# Altium schematic sheet 04_Power_Supply.SchDoc
size A4; SheetNumber: 4; SheetTotal: 6
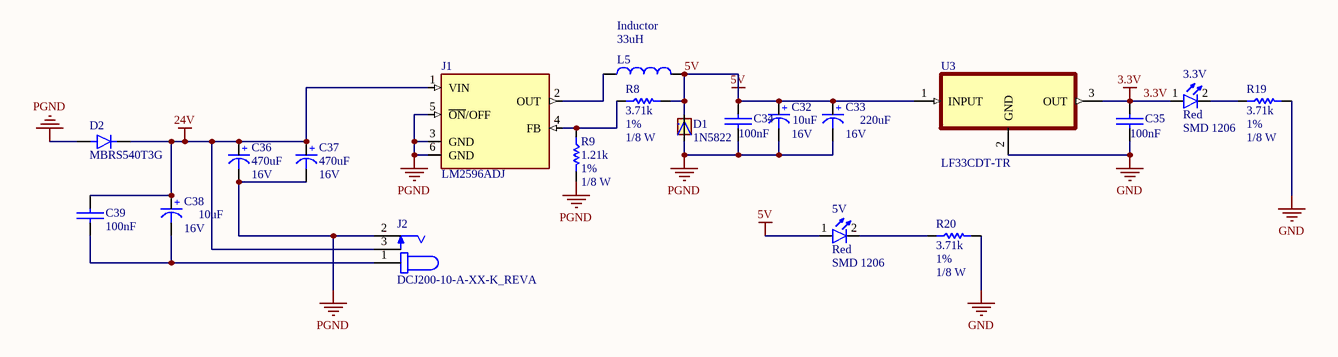
[diagram p0: 04_Power_Supply.SchDoc]

## Parts
3.3V  Size: SMD 1206  [LED SMD 1206]  (hidden comment: Red)
5V  Size: SMD 1206  [LED SMD 1206]  (hidden comment: Red)
C32  Voltage: 16V  [cap 01]  (hidden comment: 10uF)
C33  Voltage: 16V  [cap 01]  (hidden comment: 220uF)
C34  100nF  [SMD_CAP_1206]
C35  100nF  [SMD_CAP_1206]
C36  Voltage: 16V  [cap 01]  (hidden comment: 470uF)
C37  Voltage: 16V  [cap 01]  (hidden comment: 470uF)
C38  Voltage: 16V  [cap 01]  (hidden comment: 10uF)
C39  100nF  [SMD_CAP_1206]
D1  1N5822  [DIOAD2120W130L950D530P]
D2  MBRS540T3G  [DIOM7959X261N]
J1  LM2596ADJ  [LM2596ADJ]
J2  DCJ200-10-A-XX-K_REVA  [GCT_DCJ200-10-A-XX-K_REVA]
L5  Inductor  value 33uH  [INDC1608L]
R8  Tolerance: 1%  Power: 1/8 W  [RES 0805 (2012X06L)]  (hidden comment: 3.71k)
R9  Tolerance: 1%  Power: 1/8 W  [RES 0805 (2012X06L)]  (hidden comment: 1.21k)
R19  Tolerance: 1%  Power: 1/8 W  [RES 0805 (2012X06L)]  (hidden comment: 3.71k)
R20  Tolerance: 1%  Power: 1/8 W  [RES 0805 (2012X06L)]  (hidden comment: 3.71k)
U3  LF33CDT-TR  [TO228P972X240-3N]

## Nets
3.3V: 3.3V.1(A) C35.2(-) U3.3(OUT)
5V: 5V.1(A) C32.1(+) C33.1(+) C34.2(-) D1.C L5.2 R8.2 U3.1(INPUT)
24V: C36.1(+) C37.1(+) C38.1(+) C39.2(-) D2.1(C) J1.1(VIN) J2.3
GND: C35.1(+) R19.2 R20.2 U3.2(GND)
PGND: C32.2(-) C33.2(-) C34.1(+) C36.2(-) C37.2(-) D1.A D2.2(A) J1.3(GND) J1.5(~{ON}/OFF) J1.6(GND) J2.2 R9.2
Net3.3V_2: 3.3V.2(K) R19.1
Net5V_2: 5V.2(K) R20.1
NetC38_2: C38.2(-) C39.1(+) J2.1
NetJ1_2: J1.2(OUT) L5.1
NetJ1_4: J1.4(FB) R8.1 R9.1

## Library data of the parts
3.3V 5V = LED: Designer: Saeid Jorablo; Organazation: ControTec; Adding Date: 1387/12/22; Color: Red
C32 C33 C36-C38 = Cap-Polar: Polar Capacitor; Designer: Saeid Jorablo; Organazation: ControTec; Adding Date: 1387/12/20
  C32 C38: Value: 10uF
  C33: Value: 220uF
  C36 C37: Value: 470uF
C34 C35 C39 = Cap-Bipolar: Bipolar Capacitor; Voltage: 100V; Designer: Saeid Jorablo; Organazation: ControTec; Adding Date: 1387/12/20; Value: 100nF
D1 = 1N5822: Schottky, DO-201, 40V, 3A, 150Â°C; MF: Diotec Semiconductor; SnapEDA_Link: https://www.snapeda.com/parts/1N5822/Diotec/view-part/?ref=snap; Package: DO-201 Diotec; Value: *; MP: 1N5822; Check_prices: https://www.snapeda.com/parts/1N5822/Diotec/view-part/?ref=eda
D2 = MBRS540T3G: Diode Schottky 40 V 5A Surface Mount SMC; MF: ON Semiconductor; SnapEDA_Link: https://www.snapeda.com/parts/MBRS540T3G/Onsemi/view-part/?ref=snap; Package: SMC-2 ON Semiconductor; Value: *; MP: MBRS540T3G; Check_prices: https://www.snapeda.com/parts/MBRS540T3G/Onsemi/view-part/?ref=eda
J1 = LM2596ADJ: Convertidor de potencia SIMPLE SWITCHER; MF: Texas Instruments; MP: LM2596-ADJ; SnapEDA_Link: https://www.snapeda.com/parts/LM2596-ADJ/Texas+Instruments/view-part/?ref=snap; Package: None; Value: *; Check_prices: https://www.snapeda.com/parts/LM2596-ADJ/Texas+Instruments/view-part/?ref=eda
J2 = DCJ200-10-A-XX-K_REVA: Power Barrel Connector Jack 2.05mm ID (0.081), 5.50mm OD (0.217) Through Hole, Right Angle; MF: Global Connector Technology; MP: DCJ200-10-A-K1-K; SnapEDA_Link: https://www.snapeda.com/parts/DCJ200-10-A-K1-K/Global+Connector+Technology/view-part/?ref=snap; Package: None; Value: *; Check_prices: https://www.snapeda.com/parts/DCJ200-10-A-K1-K/Global+Connector+Technology/view-part/?ref=eda
L5 = Inductor: Code_IEC: 1005; Published: 8-Jun-2000; LatestRevisionDate: 29-May-2009; LatestRevisionNote: IPC-7351 Footprint Added.; PackageReference: 0402-A; Publisher: Altium Limited; PackageDescription: Chip Inductor; Code_JEITA: 0402
R8 R9 R19 R20 = Resistor
  R8 R19 R20: Value: 3.71k
  R9: Value: 1.21k
U3 = LF33CDT-TR: Linear Voltage Regulator IC Positive Fixed 1 Output 500mA DPAK; MF: STMicroelectronics; Package: TO-252-3 STMicroelectronics; Price: None; Check_prices: https://www.snapeda.com/parts/LF33CDT-TR/STMicroelectronics/view-part/?ref=eda; Value: *; SnapEDA_Link: https://www.snapeda.com/parts/LF33CDT-TR/STMicroelectronics/view-part/?ref=snap; MP: LF33CDT-TR; Availability: In Stock; Purchase-URL: https://pricing.snapeda.com/search/part/LF33CDT-TR/?ref=eda